# Altium schematic sheet 06_Power_Supply.SchDoc
size A4; CheckedBy: Doo; Author: Doo; DocumentNumber: PIF_C24_VRS02; Revision: RV_01; SheetNumber: 5; SheetTotal: 5
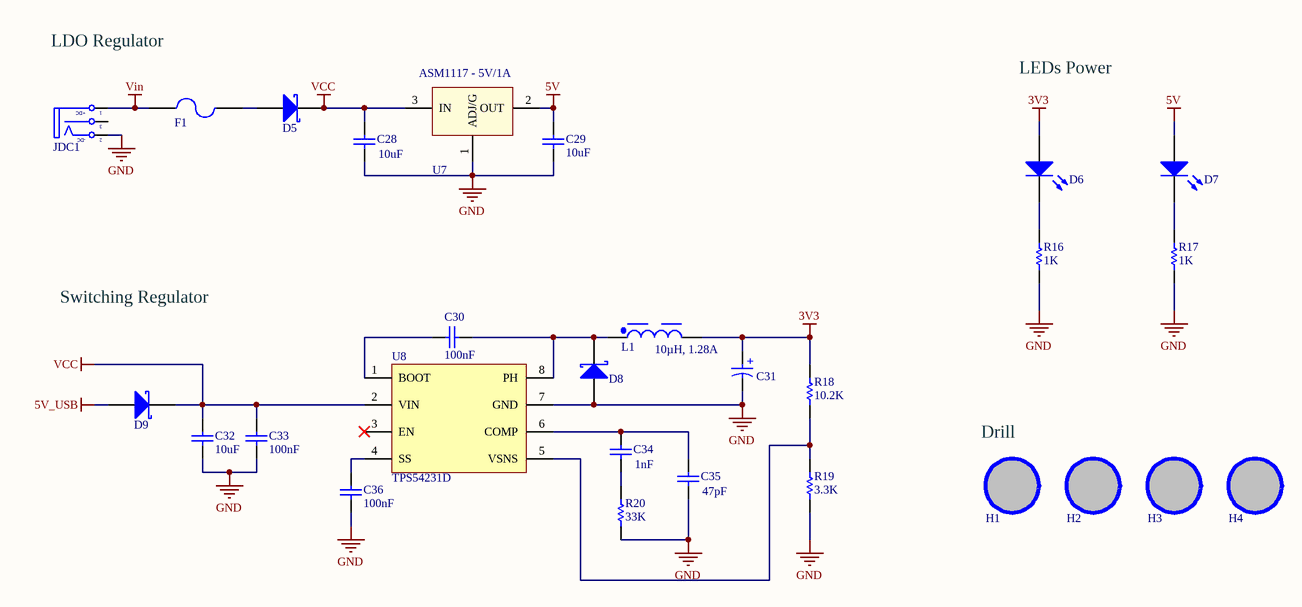
[diagram p0: 06_Power_Supply.SchDoc]

## Parts
C28  value 10uF  [CAP-SM-0805]  (hidden comment: Cap Non-Pol SMD)
C29  value 10uF  [CAP-SM-0805]  (hidden comment: Cap Non-Pol SMD)
C30  value 100nF  [CAP-SM-0805]  (hidden comment: Cap Non-Pol SMD)
C31  100uF  [WCAP-ASLI_D6.3H5.5]  (value not drawn)
C32  value 10uF  [CAP-SM-0805]  (hidden comment: Cap Non-Pol SMD)
C33  value 100nF  [CAP-SM-0805]  (hidden comment: Cap Non-Pol SMD)
C34  value 1nF  [CAP-SM-0805]  (hidden comment: Cap Non-Pol SMD)
C35  value 47pF  [CAP-SM-0805]  (hidden comment: Cap Non-Pol SMD)
C36  value 100nF  [CAP-SM-0805]  (hidden comment: Cap Non-Pol SMD)
D5  D Schottky  [SS34]  (value not drawn)
D6  LED SMD  [LED_0805_Blue]  (value not drawn)
D7  LED SMD  [LED_0805_Blue]  (value not drawn)
D8  D Schottky  [SS34]  (value not drawn)
D9  D Schottky  [SS34]  (value not drawn)
F1  Fuse  [FUSE SMD]  (value not drawn)
H1  Hole  [LO KHOAN 3MM]  (value not drawn)
H2  Hole  [LO KHOAN 3MM]  (value not drawn)
H3  Hole  [LO KHOAN 3MM]  (value not drawn)
H4  Hole  [LO KHOAN 3MM]  (value not drawn)
JDC1  Jack DC  [DC-IN]  (value not drawn)
L1  10µH, 1.28A  [WE-PD2_3521]
R16  value 1K  [RES-SM-0805]  (hidden comment: RESISTOR SMD)
R17  value 1K  [RES-SM-0805]  (hidden comment: RESISTOR SMD)
R18  value 10.2K  [RES-SM-0805]  (hidden comment: RESISTOR SMD)
R19  value 3.3K  [RES-SM-0805]  (hidden comment: RESISTOR SMD)
R20  value 33K  [RES-SM-0805]  (hidden comment: RESISTOR SMD)
U7  ASM1117 - 5V/1A  [SOT223-4N]
U8  TPS54231D  [SOIC8]

## Nets
3V3: C31.1(P) D6.1(A) L1.2 R18.2
5V: C29.2 D7.1(A) U7.2(OUT)
5V_USB: D9.1(A)
GND: C28.1 C29.1 C31.2(N) C32.1 C33.1 C35.1 C36.1 D8.1(A) JDC1.2(TN) R16.1 R17.1 R19.1 R20.1 U7.1(ADJ/G) U8.7(GND)
VCC: C28.2 C32.2 C33.2 D5.2(K) D9.2(K) U7.3(IN) U8.2(VIN)
Vin: F1.1 JDC1.1(T)
NetC30_1: C30.1 D8.2(K) L1.1 U8.8(PH)
NetC30_2: C30.2 U8.1(BOOT)
NetC34_1: C34.1 R20.2
NetC34_2: C34.2 C35.2 U8.6(COMP)
NetC36_2: C36.2 U8.4(SS)
NetD5_1: D5.1(A) F1.2
NetD6_2: D6.2(K) R16.2
NetD7_2: D7.2(K) R17.2
NetR18_1: R18.1 R19.2 U8.5(VSNS)

Not connected (* = marked no-connect by the designer): H1 1; H2 1; H3 1; H4 1; JDC1 3(S); U8 3(EN)*

## Notes on the sheet
- LDO Regulator
- LEDs Power
- Switching Regulator
- (near H1) Drill
- Title
- Size
- Date:
- Drawn By:
- A4
- YEN_DOO
- Number
- Revision
- Checked By:
- Time:
- File:
- (in symbol 865080243007) +
- (in symbol Jack DC) +DC; -DC

## Library data of the parts
C28-C30 C32-C36 = Cap Non-Pol SMD: Capacitor
C31 = 865080243007: WCAP-ASLI Aluminum Electrolytic Capacitor, V-Chip, D6.3 x H5.5mm, 100uF, 10V; Manufacturer: Wurth Elektronik; Capacitance Tolerance: +/-20%; Dissipation Factor: 19%; Endurance: 2000h; Leakage Current: 10uA; Ripple Current: 240mA; Technical Reference: ASED055101M010DVCTBB000; Manufacturer Part Number: 865080243007; Category: Aluminum Electrolytic Capacitors; Match Code: WCAP-ASLI; ComponentLink1Description: Website Link; ComponentLink1URL: https://www.we-online.com/redexpert/article/865080243007?ad; ComponentLink2Description: Datasheet Link; ComponentLink2URL: https://www.we-online.com/redexpert/spec/865080243007?ad; Mount: Surface Mount; Operating Temperature Max: 105°C; Operating Temperature Min: -55°C; Packaging: Tape and Reel; Height: 5.5mm; Diameter: 6.3mm; Capacitance: 100uF; Rated Voltage (DC): 10V
D5 D8 D9 = D Schottky: Schottky Diode; Published: 8-Jun-2000; LatestRevisionDate: 17-Jul-2002; LatestRevisionNote: Re-released for DXP Platform.; PackageReference: SMB; Publisher: Altium Limited; PackageDescription: DO-214-AA/SMB; 2 C-Bend Leads; Body 5.3 x 3.6 mm, inc. leads (LxW); Code_JEDEC: DO-214-AA
D6 D7 = LED SMD: LED
H1-H4 = Hole: Hole 3mm
JDC1 = Jack DC: Jack DC input; Value: Jac DC
L1 = 7447732110: WE-PD2 SMT Power Inductor, size 3521, 10µH, 0.8A, 0.3Ω; Manufacturer: Wurth Elektronik; Case/Size Code: 3521; DC Resistance: 0.237Ω; Saturation Current: 1.23A; Self Resonant Frequency: 45MHz; Manufacturer Part Number: 7447732110; Category: Unshielded Power Inductors; Match Code: WE-PD2; ComponentLink1Description: Website Link; ComponentLink1URL: https://www.we-online.com/redexpert/article/7447732110?ad; ComponentLink2Description: Datasheet Link; ComponentLink2URL: https://www.we-online.com/redexpert/spec/7447732110?ad; Mount: Surface Mount; Operating Temperature Max: 125°C; Operating Temperature Min: -40°C; Packaging: Tape and Reel; Length: 3mm; Width: 3.5mm; Height: 2.1mm; DC Resistance Max: 0.3Ω; Inductance: 10µH; Rated Current: 0.8A
R16-R20 = RESISTOR SMD: Resistor
U7 = LM1117: Available in 1.8V, 2.5V, 2.85V, 3.3V, 5V, and  Adjustable Versions; Value: LM317
U8 = TPS54231: Buck Switching Regulator IC Positive Adjustable 0.8V 1 Output 2A 8-SOIC (0.154", 3.90mm Width); Mfr: Texas Instruments; Function: Step-Down; Number of Outputs: 1; Voltage - Input (Min): 3.5V; Voltage - Input (Max): 28V; Voltage - Output (Max): 25V; Frequency - Switching: 570kHz; Category: Integrated Circuits (ICs); Output Configuration: Positive; Topology: Buck; Output Type: Adjustable; Voltage - Output (Min/Fixed): 0.8V; Current - Output: 2A; Operating Temperature: -40°C ~ 150°C (TJ); Mounting Type: Surface Mount; ComponentLink1Description: Thegioiic; ComponentLink1URL: https://www.thegioiic.com/tps54231dr-ic-dieu-chinh-giam-ap-2a-8-soic; ComponentLink2Description: Datasheet; ComponentLink2URL: https://www.ti.com/lit/ds/symlink/tps54231.pdf